# EAGLE design dual-relay-a-3 (EAGLE 9.6.2)
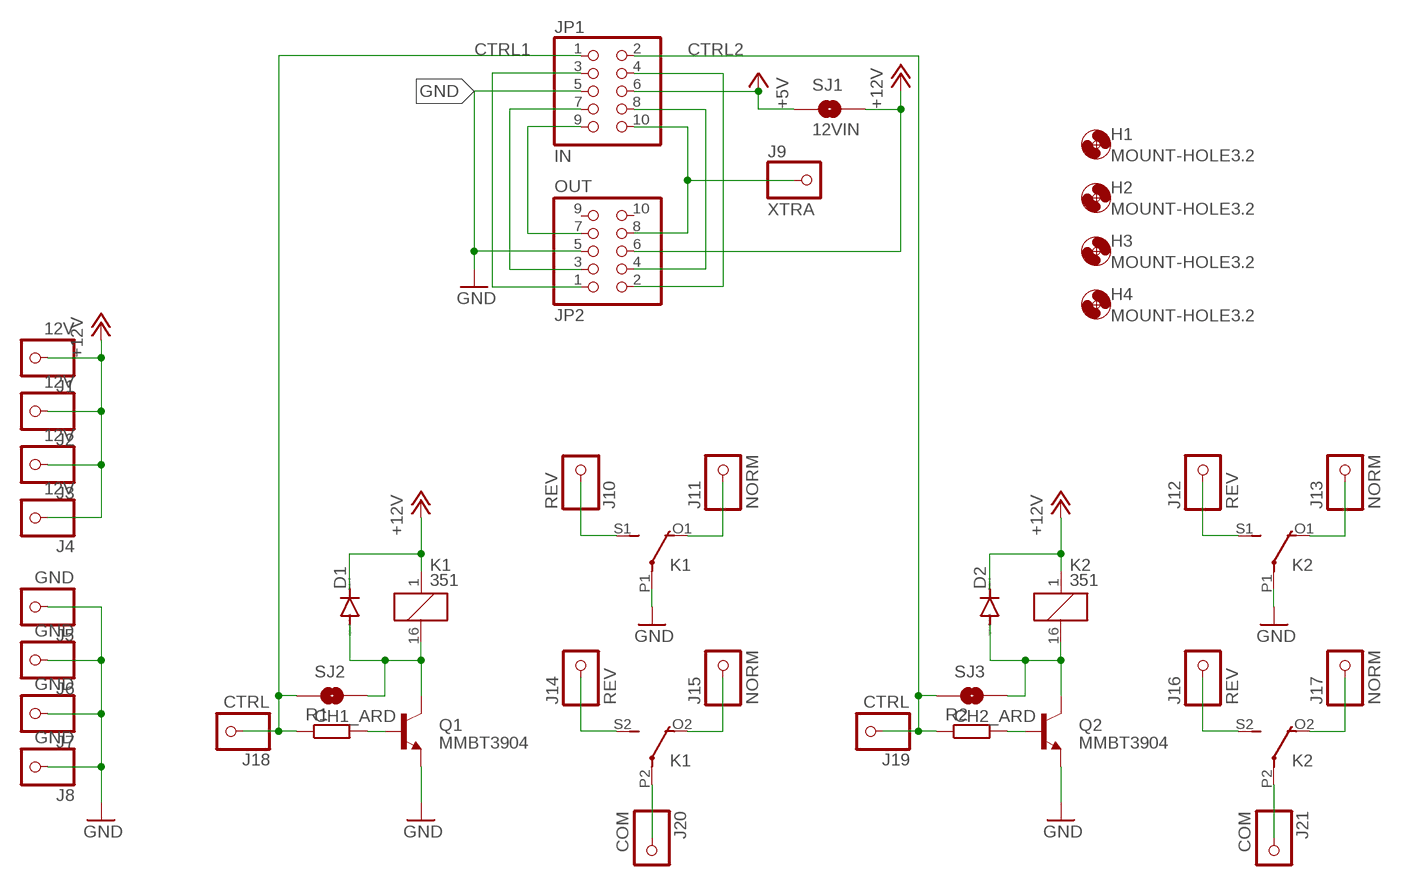
[diagram p0: schematic, sheet 1]

## Parts
D1  DIODE-MINIMELF  [MINIMELF]
D2  DIODE-MINIMELF  [MINIMELF]
H1  MOUNT-HOLE3.2  [3,2]
H2  MOUNT-HOLE3.2  [3,2]
H3  MOUNT-HOLE3.2  [3,2]
H4  MOUNT-HOLE3.2  [3,2]
J1  12V  LARGE-SOLDERPAD  [LARGE-SOLDERPAD]
J2  12V  LARGE-SOLDERPAD  [LARGE-SOLDERPAD]
J3  12V  LARGE-SOLDERPAD  [LARGE-SOLDERPAD]
J4  12V  LARGE-SOLDERPAD  [LARGE-SOLDERPAD]
J5  GND  LARGE-SOLDERPAD  [LARGE-SOLDERPAD]
J6  GND  LARGE-SOLDERPAD  [LARGE-SOLDERPAD]
J7  GND  LARGE-SOLDERPAD  [LARGE-SOLDERPAD]
J8  GND  LARGE-SOLDERPAD  [LARGE-SOLDERPAD]
J9  XTRA  LARGE-SOLDERPAD  [LARGE-SOLDERPAD]
J10  REV  LARGE-SOLDERPAD  [LARGE-SOLDERPAD]
J11  NORM  LARGE-SOLDERPAD  [LARGE-SOLDERPAD]
J12  REV  LARGE-SOLDERPAD  [LARGE-SOLDERPAD]
J13  NORM  LARGE-SOLDERPAD  [LARGE-SOLDERPAD]
J14  REV  LARGE-SOLDERPAD  [LARGE-SOLDERPAD]
J15  NORM  LARGE-SOLDERPAD  [LARGE-SOLDERPAD]
J16  REV  LARGE-SOLDERPAD  [LARGE-SOLDERPAD]
J17  NORM  LARGE-SOLDERPAD  [LARGE-SOLDERPAD]
J18  CTRL  LARGE-SOLDERPAD  [LARGE-SOLDERPAD]
J19  CTRL  LARGE-SOLDERPAD  [LARGE-SOLDERPAD]
J20  COM  LARGE-SOLDERPAD  [LARGE-SOLDERPAD]
J21  COM  LARGE-SOLDERPAD  [LARGE-SOLDERPAD]
JP1  IN  PINHD-2X5CN  [CON10M]
JP2  OUT  PINHD-2X5CN  [CON10M]
K1  351  [351]
K2  351  [351]
Q1  MMBT3904  NPN-23  [SOT23]
Q2  MMBT3904  NPN-23  [SOT23]
R1  R-EU_R0805  [R0805]
R2  R-EU_R0805  [R0805]
SJ1  12VIN  SJRND2  [SJ_RND2]
SJ2  CH1_ARD  SJRND2  [SJ_RND2]
SJ3  CH2_ARD  SJRND2  [SJ_RND2]

## Nets
+5V: JP1.6 SJ1.P$1
+12V: D1.C D2.C J1.P$1 J2.P$1 J3.P$1 J4.P$1 JP2.6 K1.1 K2.1 SJ1.P$2
CTRL1: J18.P$1 JP1.1 R1.1 SJ2.P$1
CTRL2: J19.P$1 JP1.2 R2.1 SJ3.P$1
GND: J5.P$1 J6.P$1 J7.P$1 J8.P$1 JP1.5 JP2.5 K1.P1(2:P) K2.P1(2:P) Q1.2(E) Q2.2(E)
N$1: D1.A K1.16 Q1.3(C) SJ2.P$2
N$3: Q1.1(B) R1.2
N$4: J10.P$1 K1.S1(2:S)
N$5: J11.P$1 K1.O1(2:O)
N$6: J14.P$1 K1.S2(3:S)
N$7: J15.P$1 K1.O2(3:O)
N$8: J20.P$1 K1.P2(3:P)
N$9: D2.A K2.16 Q2.3(C) SJ3.P$2
N$11: Q2.1(B) R2.2
N$12: J12.P$1 K2.S1(2:S)
N$13: J13.P$1 K2.O1(2:O)
N$14: J16.P$1 K2.S2(3:S)
N$15: J17.P$1 K2.O2(3:O)
N$16: J21.P$1 K2.P2(3:P)
N$19: JP1.3 JP2.1
N$20: JP1.7 JP2.3
N$21: JP1.8 JP2.4
N$22: J9.P$1 JP1.10 JP2.8
N$83: JP1.4 JP2.2
N$84: JP1.9 JP2.7
Unconnected: JP2.9 JP2.10

## Library data of the parts
D1 D2 = diode:DIODE-: DIODE
H1-H4 = holes:MOUNT-HOLE: MOUNTING HOLE with drill center marker
J1-J21 = eagleparts:LARGE-SOLDERPAD
JP1 JP2 = trainlib:PINHD-2X5: PIN HEADER
K1 K2 = relay:351: RELAY 2 x switch, Omron; OC_FARNELL: unknown; OC_NEWARK: unknown
Q1 Q2 = eagleparts:NPN-23
R1 R2 = rcl:R-EU_: RESISTOR, European symbol; SPICEPREFIX: R
SJ1-SJ3 = trainlib:SJ: SMD solder JUMPER

## Board
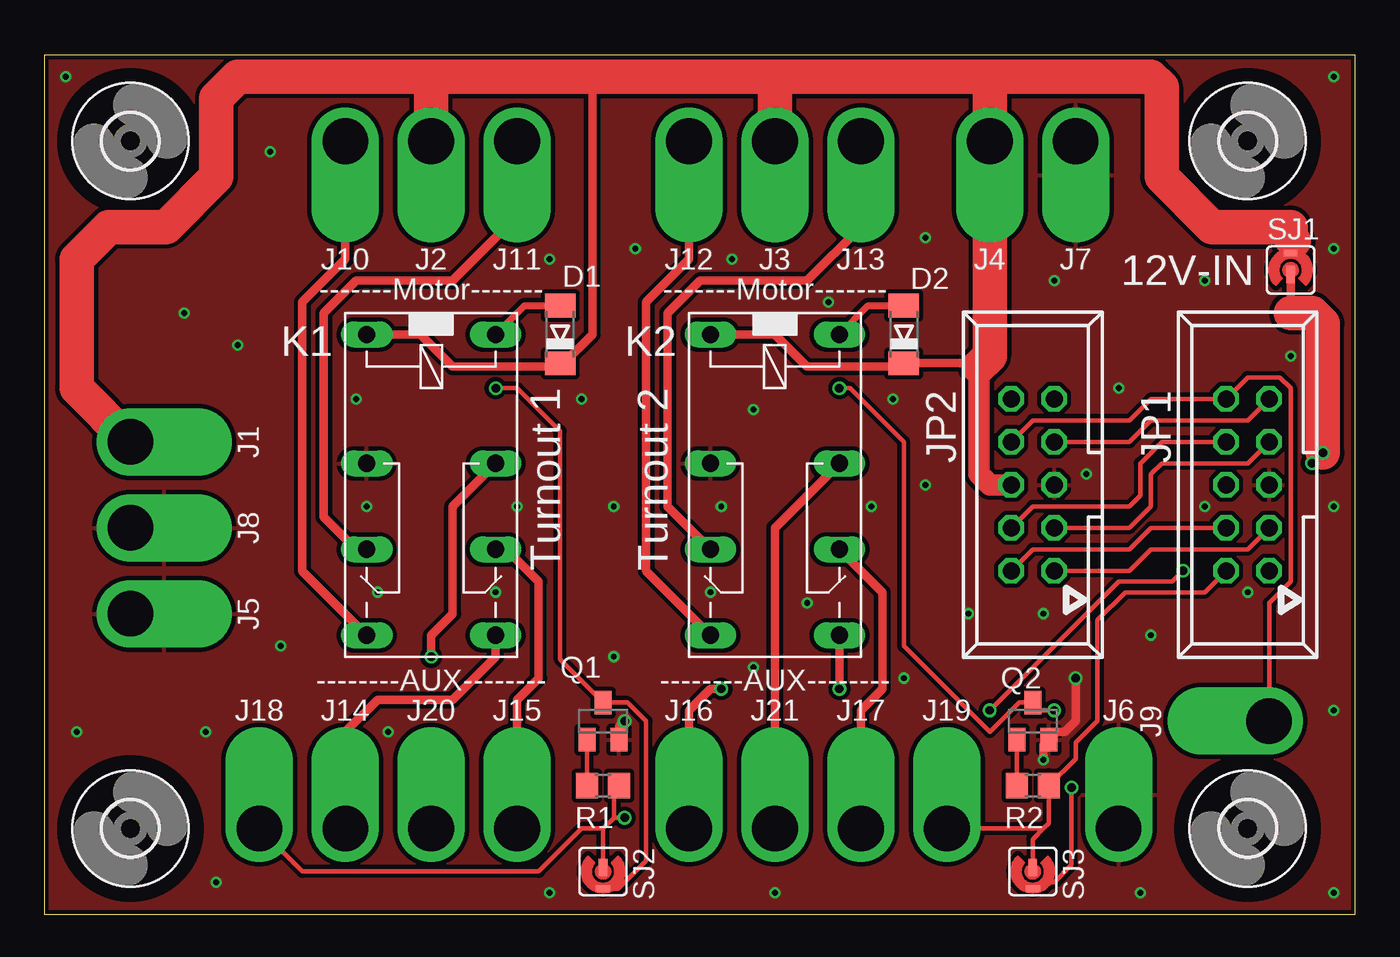
[diagram p1: board, top side]
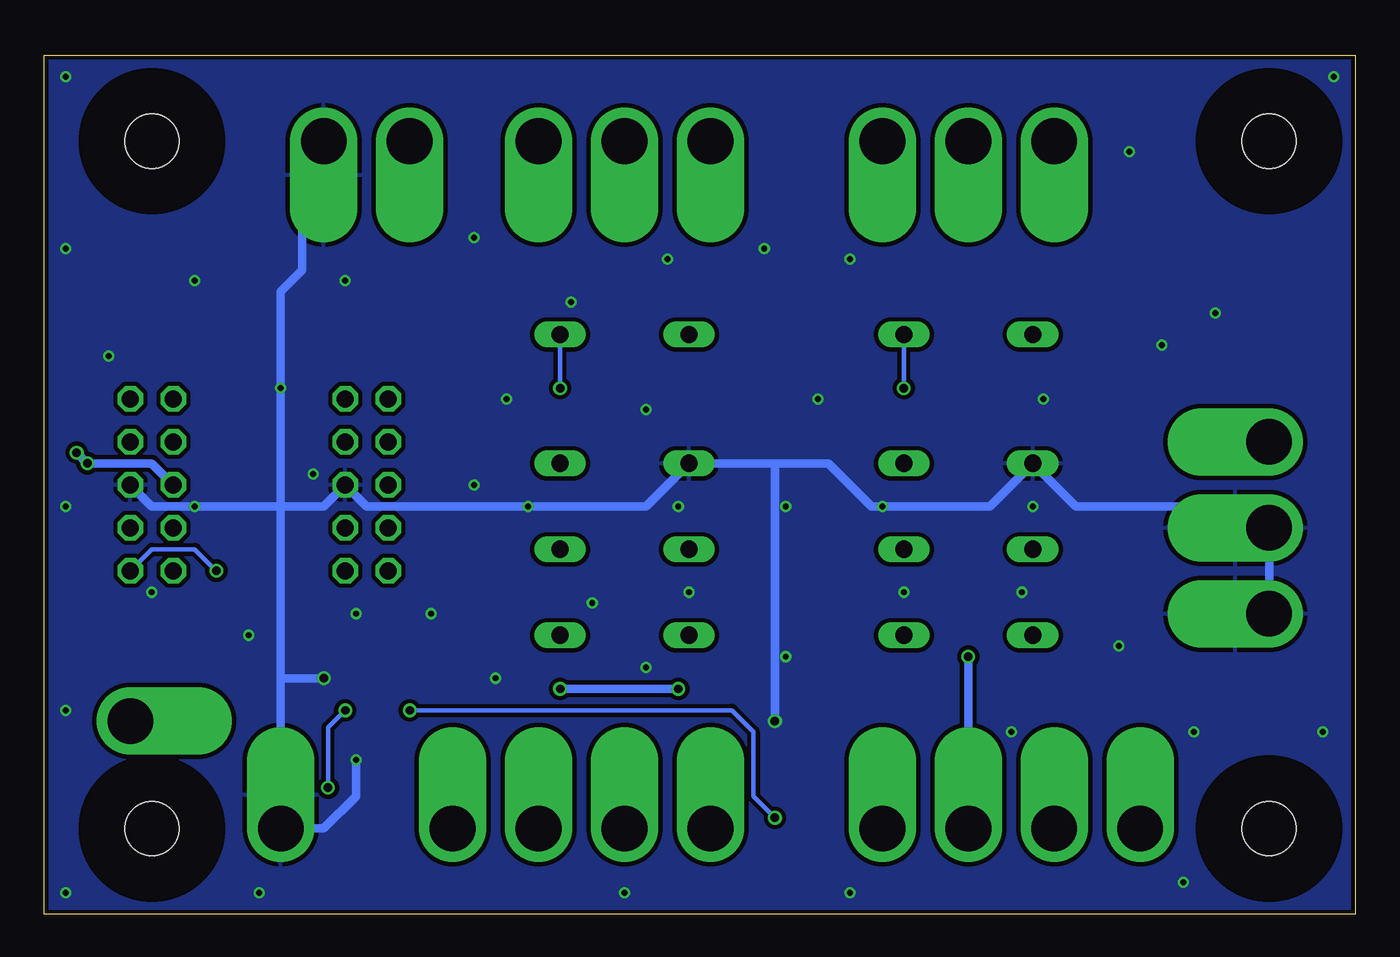
[diagram p2: board, bottom side, seen from below]

Size 77.47 x 50.8 mm. Coordinates in mm from the lower left corner, seen from the top.
Outline: 0,0 77.47,0 77.47,50.8 0,50.8 0,0
Copper layers (1*16): Top 0.035mm / dielectric 1.5mm / Bottom 0.035mm
Design rules "Fusion_eagle_rule_v1.1": minimum track width 6mil, minimum drill 12mil, track to track 6mil, track to pad 6mil, pad to pad 6mil, via to via 6mil, smd to smd 0mil, copper to edge 10mil, drill to drill 10mil, minimum pad ring 10mil, minimum via ring 6mil, stop-mask expansion 2mil, vias tented up to drill 100mil, thermal gap 10mil

### Footprints (pad centres in the part's own frame; a part is rotated, then mirrored left to right if it is on the bottom)
MINIMELF = smd 1.4 x 1.8: A 1.7,0; C -1.7,0
3,2 = hole 3.2: 0,0
LARGE-SOLDERPAD = drill 2.7 pad 4 offset: P$1 0,0
CON10M = drill 1 octagon: 1 -5.08,-1.27; 2 -5.08,1.27; 3 -2.54,-1.27; 4 -2.54,1.27; 5 0,-1.27; 6 0,1.27; 7 2.54,-1.27; 8 2.54,1.27; 9 5.08,-1.27; 10 5.08,1.27
351 = drill 1.016 long: 1 -3.81,-3.81; 16 -3.81,3.81; O1 8.89,-3.81; O2 8.89,3.81; P1 3.81,-3.81; P2 3.81,3.81; S1 13.97,-3.81; S2 13.97,3.81
SOT23 = smd 1 x 1.4: 1 -0.95,-1.1; 2 0.95,-1.1; 3 0,1.1
R0805 = smd 1.3 x 1.5: 1 -0.95,0; 2 0.95,0
SJ_RND2 = smd 1.016 x 0.508: P$1 -0.254,0 | smd 0.406 x 0.813: P$2 1.016,0

### Placement (x,y rotation side)
D1  30.48,34.29 90 top
D2  50.8,34.29 90 top
H1  5.08,45.72 0 top
H2  71.12,45.72 0 top
H3  5.08,5.08 0 top
H4  71.12,5.08 0 top
J1  5.08,27.94 270 top
J2  22.86,45.72 180 top
J3  43.18,45.72 180 top
J4  55.88,45.72 180 top
J5  5.08,17.78 270 top
J6  63.5,5.08 0 top
J7  60.96,45.72 180 top
J8  5.08,22.86 270 top
J9  72.39,11.43 90 top
J10  17.78,45.72 180 top
J11  27.94,45.72 180 top
J12  38.1,45.72 180 top
J13  48.26,45.72 180 top
J14  17.78,5.08 0 top
J15  27.94,5.08 0 top
J16  38.1,5.08 0 top
J17  48.26,5.08 0 top
J18  12.7,5.08 0 top
J19  53.34,5.08 0 top
J20  22.86,5.08 0 top
J21  43.18,5.08 0 top
JP1  71.12,25.4 90 top
JP2  58.42,25.4 90 top
K1  22.86,30.48 270 top
K2  43.18,30.48 270 top
Q1  33.02,11.43 0 top
Q2  58.42,11.43 0 top
R1  33.02,7.62 180 top
R2  58.42,7.62 180 top
SJ1  73.66,38.1 90 top
SJ2  33.02,2.54 270 top
SJ3  58.42,2.54 270 top

### Tracks (layer width: path | path; a pad name or v marks a point on that pad's centre or on a via)
+5V  (via drill 0.5)
  Top 0.508: SJ1.P$1 73.66,36.2 74.3,36.2 74.93,35.56
  Top 2.032: v75.56,27.3 75.56,34.92 74.93,35.56 73.66,35.56
  Bottom 0.508: JP1.6 71.12,26.67 v74.93,26.67 v75.56,27.3
+12V
  Top 0.508: 73.66,40.64 SJ1.P$2 | K1.1 22.23,34.29 24.13,32.38 30.27,32.38 D1.C 30.68,32.59 32.38,34.29 32.38,49.53 | K2.1 43.18,34.29 45.09,32.38 50.59,32.38 D2.C 55.45,32.59 55.88,33.02
  Top 1.27: JP2.6 55.88,25.4 55.24,26.04 55.24,32.38
  Top 2.032: 22.86,49.53 32.38,49.53 43.18,49.53 | J3.P$1 43.18,49.53 | J2.P$1 22.86,49.53 | 43.18,49.53 55.88,49.53 | 55.88,49.53 J4.P$1 55.88,33.02 55.24,32.38 | 55.88,49.53 65.41,49.53 66.04,48.9 66.04,43.62 69.02,40.64 73.66,40.64 73.66,40 73.86,39.8 | 22.86,49.53 11.43,49.53 10.16,48.26 10.16,43.62 7.18,40.64 3.81,40.64 1.91,38.73 1.91,31.11 J1.P$1
CTRL1  (via drill 0.5)
  Top 0.254: v67.31,20.32 66.67,19.68 63.5,19.68 v55.88,12.06 | R1.1 33.66,7.3 33.66,5.71 | 33.02,5.08 33.66,5.71 | SJ2.P$1 33.02,5.08 | 33.02,5.08 31.75,5.08 29.21,2.54 15.24,2.54 J18.P$1 | 33.66,5.71 v34.29,5.71
  Bottom 0.254: JP1.1 71.12,21.59 68.58,21.59 v67.31,20.32 | v55.88,12.06 36.83,12.06 35.56,10.79 35.56,6.99 v34.29,5.71
CTRL2
  Top 0.254: JP1.2 68.58,19.05 63.88,19.05 62.23,17.4 62.23,11.43 60.96,10.16 60.96,9.21 R2.1 | 59.37,8.26 R2.1 | R2.1 59.37,5.39 59.05,5.08 | 59.05,5.08 58.42,4.45 SJ3.P$1 | J19.P$1 59.05,5.08
GND  (via drill 0.35, 0.5)
  Top 0.508: v59.05,9.14 59.05,10.02 Q2.2 59.84,10.79 60.33,10.79 60.96,11.43 v60.96,13.97 | Q1.2 33.97,11.11 v34.29,11.43
  Bottom 0.508: JP1.5 71.12,24.13 63.5,24.13 | 63.5,24.13 60.96,24.13 JP2.5 58.42,24.13 41.91,24.13 K2.P1 34.29,26.67 | 63.5,13.97 J6.P$1 60.96,5.08 59.05,6.99 v59.05,9.14 | 63.5,13.97 63.5,24.13 | v60.96,13.97 63.5,13.97 | J7.P$1 62.23,44.45 62.23,38.1 63.5,36.83 63.5,24.13 | v34.29,11.43 34.29,26.67 | 34.29,26.67 31.11,26.67 28.57,24.13 21.59,24.13 K1.P1 16.51,24.13 6.35,24.13 J8.P$1 J5.P$1
  other vias: 8.26,35.56 13.34,45.09 1.27,49.53 11.43,33.66 1.91,10.79 9.53,10.79 10.16,1.91 29.84,1.27 43.18,1.27 64.77,1.27 76.2,1.27 76.2,12.06 76.2,24.13 76.2,39.37 76.2,49.53 59.69,37.47 68.58,37.47 63.5,31.11 61.59,26.04 68.58,24.13 54.61,17.78 48.9,24.13 41.91,29.84 33.66,24.13 31.75,30.48 27.94,24.13 33.66,15.24 41.91,14.61 45.09,18.41 40.01,24.13 39.37,19.05 26.67,19.05 19.68,19.05 20.32,10.79 13.97,15.88 19.05,24.13 18.41,30.48 34.92,39.37 29.84,38.73 40.64,38.73 46.35,36.2 52.07,40.01 50.16,30.48 65.41,16.51 71.12,19.05 73.66,33.02 59.05,17.78 52.07,25.4 50.8,13.97
  pour Top (isolate 0.254): 0,50.8 77.47,50.8 77.47,0 0,0
  pour Bottom (isolate 0.254): 0,50.8 77.47,50.8 77.47,0 0,0
N$1  (via drill 0.5)
  Top 0.254: v26.67,31.11 27.94,31.11 30.48,28.57 30.48,15.07 Q1.3 34.46,12.53 35.56,11.43 35.56,3.17 33.91,1.52 SJ2.P$2
  Top 0.406: K1.16 28.37,35.99 D1.A
  Bottom 0.254: v26.67,31.11 K1.16
N$3
  Top 0.254: Q1.1 R1.2
N$4
  Top 0.508: J10.P$1 17.78,38.73 15.24,36.2 15.24,20.32 K1.S1
N$5
  Top 0.508: J11.P$1 27.94,41.27 24.13,37.47 18.41,37.47 16.51,35.56 16.51,23.5 18.41,21.59 K1.O1
N$6
  Top 0.508: J14.P$1 17.78,10.79 19.68,12.7 24.13,12.7 26.67,15.24 K1.S2
N$7
  Top 0.508: J15.P$1 27.94,12.7 29.21,13.97 29.21,19.68 27.3,21.59 K1.O2
N$8  (via drill 0.5)
  Top 0.508: v22.86,15.24 22.86,16.51 24.13,17.78 24.13,24.13 K1.P2
  Bottom 0.508: J20.P$1 v22.86,15.24
N$9  (via drill 0.5)
  Top 0.254: SJ3.P$2 59.05,1.52 59.44,1.91 59.69,1.91 60.71,2.92 v60.71,7.49 | v59.69,12.06 58.88,12.06 Q2.3 57.62,12.53 55.88,10.79 50.8,15.88 50.8,27.94 47.62,31.11 v46.99,31.11
  Top 0.406: K2.16 48.69,35.99 D2.A
  Bottom 0.254: v60.71,7.49 60.71,11.05 v59.69,12.06 | v46.99,31.11 K2.16
N$11
  Top 0.254: Q2.1 R2.2
N$12
  Top 0.508: J12.P$1 38.1,38.73 35.56,36.2 35.56,20.32 K2.S1
N$13
  Top 0.508: J13.P$1 48.26,40.64 45.09,37.47 38.73,37.47 36.83,35.56 36.83,24.13 K2.O1
N$14  (via drill 0.5)
  Top 0.508: J16.P$1 38.1,12.06 39.37,13.34 v40.01,13.34 | v46.99,13.34 K2.S2
  Bottom 0.508: v40.01,13.34 v46.99,13.34
N$15
  Top 0.508: J17.P$1 48.26,12.06 49.53,13.34 49.53,19.05 K2.O2
N$16
  Top 0.508: J21.P$1 43.18,22.86 K2.P2
N$19
  Top 0.254: JP1.3 71.12,21.59 65.41,21.59 64.14,20.32 JP2.1
N$20
  Top 0.254: JP1.7 71.12,26.67 66.04,26.67 65.41,26.04 65.41,24.13 64.14,22.86 JP2.3
N$21
  Top 0.254: JP1.8 66.04,27.94 64.77,26.67 64.77,24.77 64.14,24.13 58.42,24.13 JP2.4
N$22
  Top 0.254: JP2.8 58.42,29.21 64.14,29.21 65.41,30.48 JP1.10 71.12,31.75 73.03,31.75 73.66,31.11 73.66,19.68 72.39,18.41 J9.P$1
N$83
  Top 0.254: JP2.2 58.42,21.59 64.14,21.59 65.41,22.86 JP1.4
N$84
  Top 0.254: JP1.9 71.12,29.21 65.41,29.21 64.14,27.94 JP2.7

### Text on the board
tNames: -------Motor------- | -------Motor------- | 12V-IN | Turnout 1 | Turnout 2 | --------AUX-------- | --------AUX--------